# Altium schematic sheet Sheet1.SchDoc
size A4; SheetNumber: 1; SheetTotal: 4
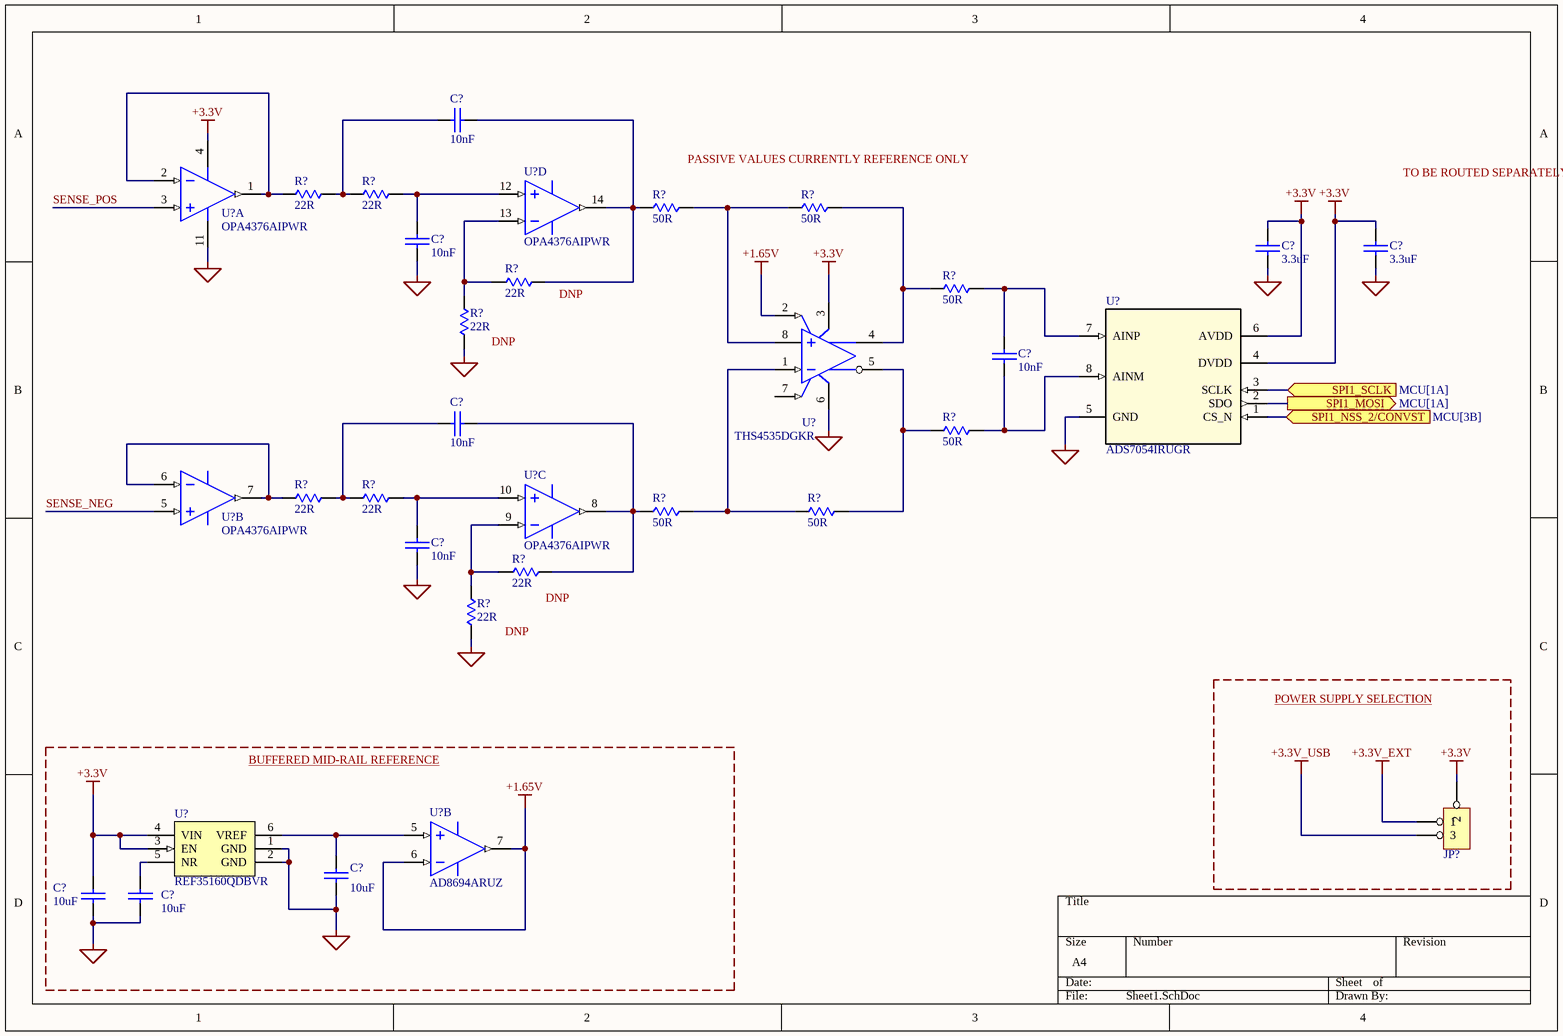
[diagram p0: Sheet1.SchDoc]

## Parts
(Parts that share a designator on the sheet are numbered #1, #2 ... from top to bottom, then left to right.)
C?#1  10nF  [0805-CAP]
C?#2  10nF  [0805-CAP]
C?#3  3.3uF  [0603-CAP]
C?#4  3.3uF  [0603-CAP]
C?#5  10nF  [0805-CAP]
C?#6  10nF  [0805-CAP]
C?#7  10nF  [0805-CAP]
C?#8  10uF  [0805-CAP]
C?#9  10uF  [0805-CAP]
C?#10  10uF  [0805-CAP]
JP?  JUMPER1X3  [JUMPER3]  (value not drawn)
R?#1  22R  [0603-RES]
R?#2  22R  [0603-RES]
R?#3  50R  [0603-RES]
R?#4  50R  [0603-RES]
R?#5  22R  [0603-RES]
R?#6  50R  [0603-RES]
R?#7  22R  [0603-RES]
R?#8  50R  [0603-RES]
R?#9  22R  [0603-RES]
R?#10  22R  [0603-RES]
R?#11  50R  [0603-RES]
R?#12  50R  [0603-RES]
R?#13  22R  [0603-RES]
R?#14  22R  [0603-RES]
U?#1  OPA4376AIPWR  [PW0014A_M]  (part A of 4)
U?#2  OPA4376AIPWR  [PW0014A_M]  (part D of 4)
U?#3  THS4535DGKR  [VSSOP-8]
U?#4  ADS7054IRUGR  [8-X2QFN (1.5x1.5)]
U?#5  OPA4376AIPWR  [PW0014A_M]  (part B of 4)
U?#6  OPA4376AIPWR  [PW0014A_M]  (part C of 4)
U?#7  REF35160QDBVR  [SOT-23-6]
U?#8  AD8694ARUZ  [ADI-RU-14_L]  (part B of 4)

## Blocks framed on the sheet
POWER SUPPLY SELECTION: JP?
BUFFERED MID-RAIL REFERENCE: C?#8-C?#10 U?#7 U?#8

## Ports
SPI1_MOSI (out, see MCU[1A]), SPI1_NSS_2/CONVST (in, see MCU[3B]), SPI1_SCLK (in, see MCU[1A])

## Nets
+1.65V: U?#3.2(VOCM) U?#8.6(-IN_B) U?#8.7(OUT_B)
+3.3V: C?#3.2 C?#4.2 C?#9.2 JP?.2 U?#1.4(V+) U?#3.3(VS+) U?#4.4(DVDD) U?#4.6(AVDD) U?#7.3(EN) U?#7.4(VIN)
+3.3V_EXT: JP?.1
+3.3V_USB: JP?.3
GND: C?#2.1 C?#3.1 C?#4.1 C?#7.1 C?#8.1 C?#9.1 C?#10.1 R?#7.2 R?#14.2 U?#1.11(V-) U?#3.6(VS-) U?#4.5(GND) U?#7.1(GND) U?#7.2(GND)
SENSE_NEG: U?#5.5(IN_B+)
SENSE_POS: U?#1.3(IN_A+)
SPI1_MOSI: U?#4.2(SDO) ; port SPI1_MOSI
SPI1_NSS_2/CONVST: U?#4.1(CS_N) ; port SPI1_NSS_2/CONVST
SPI1_SCLK: U?#4.3(SCLK) ; port SPI1_SCLK
NetC?#1_1: C?#1.1 R?#3.1 R?#5.1 U?#2.14(OUT_D)
NetC?#1_2: C?#1.2 R?#1.2 R?#2.1
NetC?#2_2: C?#2.2 R?#2.2 U?#2.12(IN_D+)
NetC?#5_1: C?#5.1 R?#6.2 U?#4.7(AINP)
NetC?#5_2: C?#5.2 R?#8.2 U?#4.8(AINM)
NetC?#6_1: C?#6.1 R?#11.1 R?#13.1 U?#6.8(OUT_C)
NetC?#6_2: C?#6.2 R?#9.2 R?#10.1
NetC?#7_2: C?#7.2 R?#10.2 U?#6.10(IN_C+)
NetC?#8_2: C?#8.2 U?#7.6(VREF) U?#8.5(+IN_B)
NetC?#10_2: C?#10.2 U?#7.5(NR)
NetR?#1_1: R?#1.1 U?#1.1(OUT_A) U?#1.2(IN_A-)
NetR?#3_2: R?#3.2 R?#4.1 U?#3.8(VIN+)
NetR?#4_2: R?#4.2 R?#6.1 U?#3.4(VOUT+)
NetR?#5_2: R?#5.2 R?#7.1 U?#2.13(IN_D-)
NetR?#8_1: R?#8.1 R?#12.2 U?#3.5(VOUT-)
NetR?#9_1: R?#9.1 U?#5.6(IN_B-) U?#5.7(OUT_B)
NetR?#11_2: R?#11.2 R?#12.1 U?#3.1(VIN-)
NetR?#13_2: R?#13.2 R?#14.1 U?#6.9(IN_C-)

Not connected (* = marked no-connect by the designer): U?#3 7(~{PD})

## Notes on the sheet
- (near R?#4) PASSIVE VALUES CURRENTLY REFERENCE ONLY
- TO BE ROUTED SEPARATELY
- (near R?#5) DNP
- (near R?#7) DNP
- (near R?#14) DNP
- (near R?#13) DNP

## Library data of the parts
C?#1 C?#2 C?#5-C?#7 = CL21B104KCFNNNE: CAP CER 0.01UF 100V X7R 0805; Manufacturer 1: Samsung; Detailed Description: CAP CER 0.1UF 100V X7R 0805; Tech#: SMT; Manufacturer Part Number 1: CL21B104KCFNNNE; Supplier 1: DigiKey; Supplier Part Number 1: 1276-6840-1-ND; Supplier 2: Mouser; Supplier Part Number 2: 791-0603B104K101CT; Price(100): 0.019
C?#3 C?#4 = CGA3E2C0G1H472J080AA: CAP CER 4700PF 50V C0G 0603; Manufacturer 1: TDK Corporation; Tech#: SMT; Manufacturer Part Number 1: CGA3E2C0G1H472J080AA; Detailed Description: CAP CER 4700PF 50V C0G 0603; Supplier 1: DigiKey; Supplier Part Number 1: 445-6912-1-ND; Supplier 2: Mouser; Supplier Part Number 2: 810-CGA3E2C0G1H472J; Price(100): 0.1434; Price(250): 0.10756
C?#8-C?#10 = CL21B104KCFNNNE: CAP CER 10UF 100V X7R 0805; Manufacturer 1: Samsung; Detailed Description: CAP CER 0.1UF 100V X7R 0805; Tech#: SMT; Manufacturer Part Number 1: CL21B104KCFNNNE; Supplier 1: DigiKey; Supplier Part Number 1: 1276-6840-1-ND; Supplier 2: Mouser; Supplier Part Number 2: 791-0603B104K101CT; Price(100): 0.019
JP? = 68001-203HLF: CONN HEADER VERT 36POS 2.54MM; Manufacturer 1: FCI; Detailed Description: Jumper, 1x3 Vertical T/H 0.1in; Location: #N/A; Notes: Can be 68001-236HLF cut to length; Tech#: T/H; Manufacturer Part Number 1: 68001-203HLF; Supplier 1: DigiKey; Supplier Part Number 1: 609-3470-ND; Supplier 2: Mouser; Supplier Part Number 2: 649-68001-203HLF; Price(1): 0.43; Price(10): 0.32; Price(25): 0.32; Price(100): 0.2436
R?#1-R?#14 = 4.99K 0603: RES SMD 50OHM 0.5% 1/16W 0603; Manufacturer Part Number 1: RR0816P-4991-D-68H; Manufacturer 1: Susumu; Detailed Description: RES SMD 4.99KOHM 0.5% 1/16W 0603; Tech#: SMT; Supplier 1: DigiKey; Supplier Part Number 1: RR08P4.99KDCT-ND; Supplier 2: Mouser; Supplier Part Number 2: 754-RR0816P-4991D68H; Price(100): 0.023
U?#1 U?#2 U?#5 U?#6 = CMP-0272-01754-3: Precision, Low Noise, Low Quiescent Current Operational Amplifier, 2 to 5.5 V, -40 to 125 degC, 14-pin SOP (PW14), Green (RoHS & no Sb/Br); Manufacturer: Texas Instruments; Sub Family: Low Input Bias Current Amp (<=10pA), Low Noise Amp (<=10nV/rtHz), Low Offset Voltage Amplifier (<=500uV), Low Supply Voltage Amplifier (<=2.7V), Precision Amplifier; Number of Channels: 4; IIB(Max)(pA): 10; Total Supply Voltage(Max)(+5V is 5, +/-5V is 10): 5.5; Iq per channel(Max)(mA): 0.95; Vn at 1kHz(Typ)(nV/rtHz): 7.5; CMRR(Min)(dB): 76; Slew Rate(Typ)(V/us): 2; Offset Drift(Typ)(uV/C): 0.32; Vio (25C)(Max)(mV): 0.025; DatasheetVersion: SBOS406F; ComponentLink3URL: http://www.ti.com/litv/pdf/mpds360; PackageDescription: 14-Pin Plastic Small Outline, Body 5 x 4.4 mm, Pitch 0.65 mm; ComponentLink2URL: http://www.ti.com/general/docs/lit/getliterature.tsp?genericPartNumber=OPA4376&fileType=pdf; ComponentLink1Description: Manufacturer URL; PackageVersion: 4040064-3/G, 02/2011; PartNumber: OPA4376AIPWR; Eco-Plan: Green (RoHS & no Sb/Br); Mounting Technology: Surface Mount; PackageReference: PW0014A; Total Supply Voltage(Min)(+5V is 5, +/-5V is 10): 2; Code_JEDEC: MO-153; ComponentLink3Description: Package Specification; ComponentLink2Description: Datasheet; ComponentLink1URL: http://www.ti.com/
U?#4 = ADS7054IRUGR: 14-Bit, 1MSPS, Differential Input, Small-Size Low-Power SAR ADC 8-X2QFN -40 to 125; Manufacturer_Name: Texas Instruments; TYPE: TYPE; RefDes: RefDes; Copyright: Copyright (C) 2026 Ultra Librarian. All rights reserved.; Manufacturer_Part_Number: ADS7054IRUGR
U?#7 = REF35160QDBVR: 650-nA quiescent current, 12-ppm/Â°C drift, ultra-low-power precision voltage reference 6-SOT-23 -40 to 125; Manufacturer_Name: Texas Instruments; TYPE: TYPE; RefDes: RefDes; Copyright: Copyright (C) 2025 Ultra Librarian. All rights reserved.; Manufacturer_Part_Number: REF35160QDBVR
U?#8 = CMP-0384-01915-1: Quad Channel Wide Bandwidth Operational Amplifier, 10 MHz BW, 5 V/us SR, Industrial, 14-pin SOP (RU-14), Tube; Manufacturer: Analog Devices; Generic Part Number: AD8694; Input Bias Current: 200fA; Amplifiers Per Package: 4; Automotive Qualified: Yes; V Span Max: 6V; V Span Min: 2.7V; Iq/Amp: 1.2mA; Slew Rate: 5V/us; Small Signal Bandwidth: 10MHz; Input Offset Voltage: 400uV; PackageReference: RU-14; ComponentLink3URL: http://www.analog.com/static/imported-files/packages/36057385283879153717235186773RU14.pdf; ComponentLink3Description: Package Specification; Mounting Technology: Surface Mount; PackageDescription: 14-Pin Thin Shrink Small Outline Package, Body 5 x 4.4 mm, Pitch 0.65 mm; DatasheetVersion: Rev. E; Code_JEDEC: MO-153AB-1; ComponentLink1Description: Manufacturer URL; ComponentLink2URL: http://www.analog.com/static/imported-files/data_sheets/AD8691_8692_8694.pdf; ComponentLink2Description: Datasheet; ComponentLink1URL: http://www.analog.com/en/index.html; PartNumber: AD8694ARUZ